# EAGLE design 405_led_jetracer020002S (EAGLE 9.6.2)

## Sheet 1 of 2
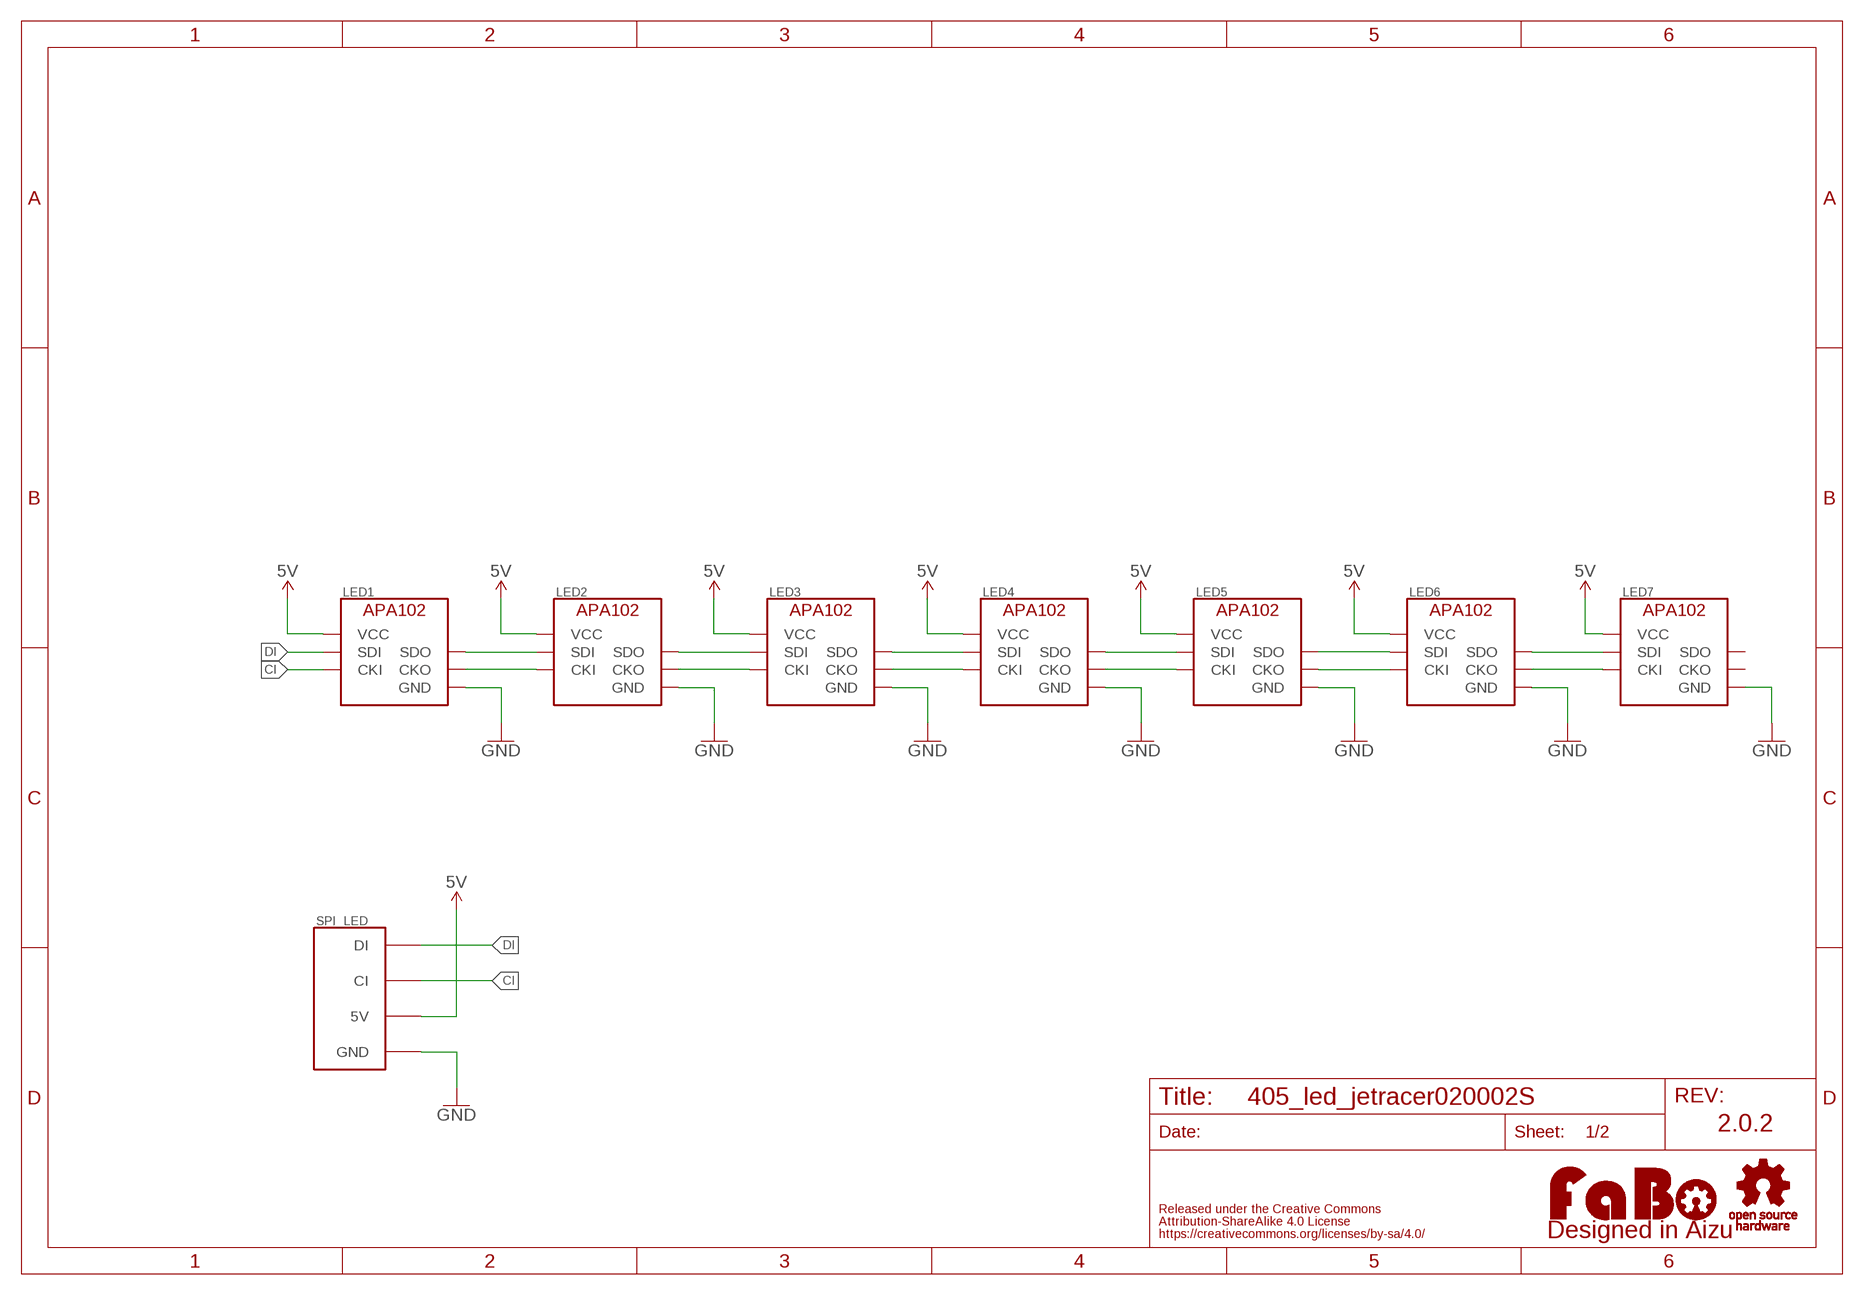
[diagram p0: schematic, sheet 1]

### Parts
LED1  APA102_IPIXEL  [APA102_2020]
LED2  APA102_IPIXEL  [APA102_2020]
LED3  APA102_IPIXEL  [APA102_2020]
LED4  APA102_IPIXEL  [APA102_2020]
LED5  APA102_IPIXEL  [APA102_2020]
LED6  APA102_IPIXEL  [APA102_2020]
LED7  APA102_IPIXEL  [APA102_2020]
LOGO1  LOGO_OSHW-S_BOTTOM  [LOGO_OSHW_S_BOTTOM]
LOGO2  LOGO_FABO-S  [LOGO_FABO_S]
SPI_LED  SPI-LED  FABO_BRICK_SPI_LED-S04B-PASK-2  [FABO_BRICK_SPI_LED_S04B-PASK-2]

### Nets
5V: LED1.VCC LED2.VCC LED3.VCC LED4.VCC LED5.VCC LED6.VCC LED7.VCC SPI_LED.5V
CI: LED1.CKI SPI_LED.CI
CI1: LED1.CKO LED2.CKI
CI2: LED2.CKO LED3.CKI
CI3: LED3.CKO LED4.CKI
CI4: LED4.CKO LED5.CKI
CI5: LED5.CKO LED6.CKI
DI: LED1.SDI SPI_LED.DI
DI1: LED1.SDO LED2.SDI
DI2: LED2.SDO LED3.SDI
DI3: LED3.SDO LED4.SDI
DI4: LED4.SDO LED5.SDI
DI5: LED5.SDO LED6.SDI
GND: LED1.GND LED2.GND LED3.GND LED4.GND LED5.GND LED6.GND LED7.GND SPI_LED.GND
N$3: LED6.SDO LED7.SDI
N$4: LED6.CKO LED7.CKI
Unconnected: LED7.CKO LED7.SDO

### Notes on the sheet
- 2.0.2

## Sheet 2 of 2
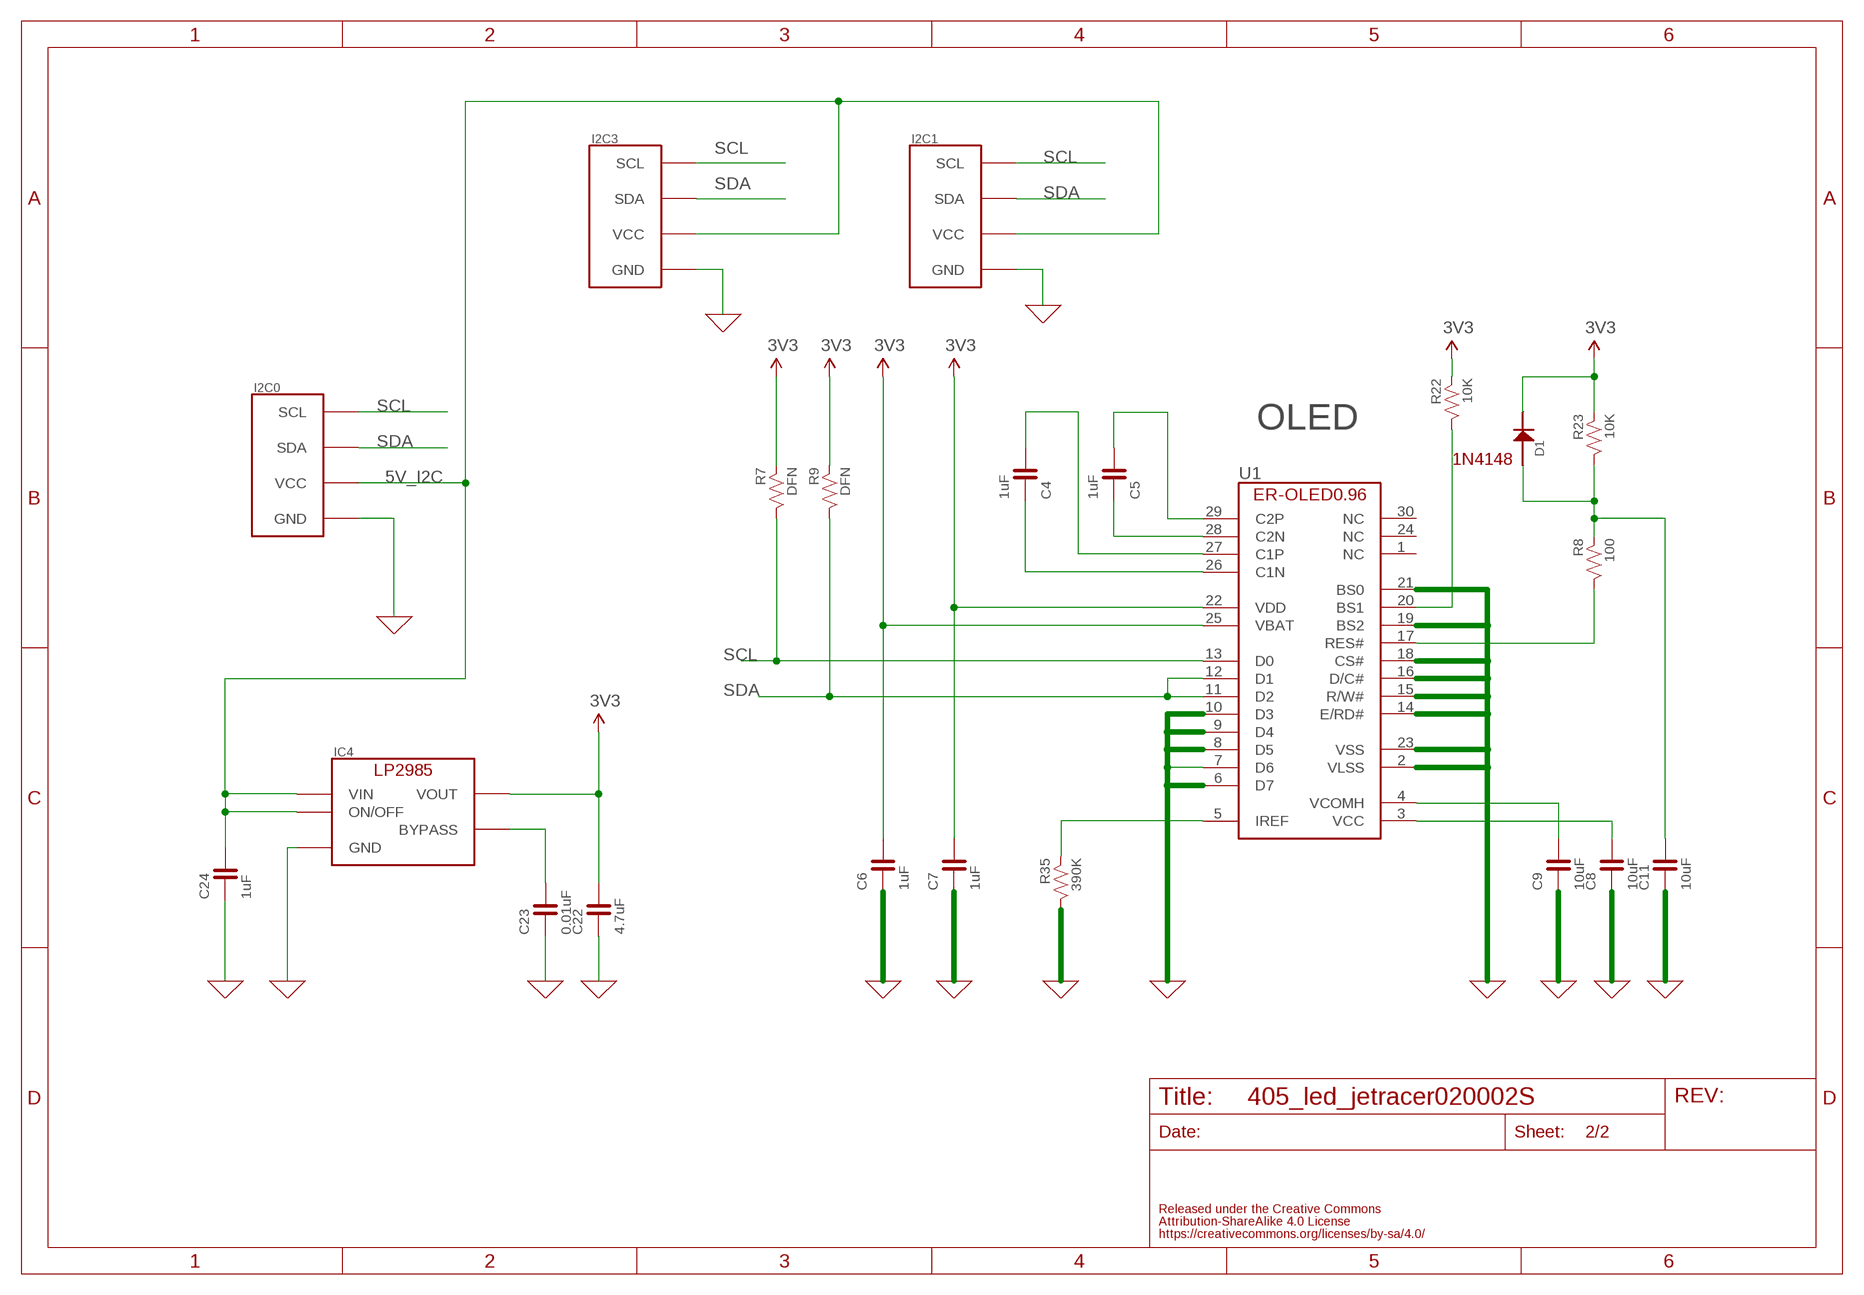
[diagram p1: schematic, sheet 2]

### Parts
C4  1uF  CAPACITOR-0603  [0603]
C5  1uF  CAPACITOR-0603  [0603]
C6  1uF  CAPACITOR-0603  [0603]
C7  1uF  CAPACITOR-0603  [0603]
C8  10uF  CAPACITOR-0603  [0603]
C9  10uF  CAPACITOR-0603  [0603]
C11  10uF  CAPACITOR-0603  [0603]
C22  4.7uF  CAPACITOR-0603  [0603]
C23  0.01uF  CAPACITOR-0603  [0603]
C24  1uF  CAPACITOR-0603  [0603]
D1  1N4148  [1N4148W]
I2C0  FABO_BRICK_I2C-S04B-PASK-2  [FABO_BRICK_I2C_S04B-PASK-2]
I2C1  FABO_BRICK_I2C-S04B-PASK-2  [FABO_BRICK_I2C_S04B-PASK-2]
I2C3  FABO_BRICK_I2C-S04B-PASK-2  [FABO_BRICK_I2C_S04B-PASK-2]
IC4  LP2985-33DBV  [SOT-23-5]
R7  DFN  RESISTOR-0603  [0603]
R8  100  RESISTOR-0603  [0603]
R9  DFN  RESISTOR-0603  [0603]
R22  10K  RESISTOR-0603  [0603]
R23  10K  RESISTOR-0603  [0603]
R35  390K  RESISTOR-0603  [0603]
U1  ER-OLED0.96-1ER-CON30HT-1  [ER-CON30HT-1]

### Nets
0: C6.1 C7.1 C8.1 C9.1 C11.1 C22.1 C23.1 C24.1 I2C0.GND I2C1.GND I2C3.GND IC4.2(GND) R35.2 U1.2(VLSS) U1.6(D7) U1.7(D6) U1.8(D5) U1.9(D4) U1.10(D3) U1.14(E/RD#) U1.15(R/W#) U1.16(D/C#) U1.18(CS#) U1.19(BS2) U1.21(BS0) U1.23(VSS) ; supply symbol labelled GND
3V3: C6.2 C7.2 C22.2 D1.CATHODE IC4.5(VOUT) R7.1 R9.1 R22.1 R23.1 U1.22(VDD) U1.25(VBAT)
5V_I2C: C24.2 I2C0.VCC I2C1.VCC I2C3.VCC IC4.1(VIN) IC4.3(ON/OFF)
N$2: C23.2 IC4.4(BYPASS)
N$16: C4.2 U1.27(C1P)
N$21: C4.1 U1.26(C1N)
N$22: C5.1 U1.28(C2N)
N$23: C5.2 U1.29(C2P)
N$24: R35.1 U1.5(IREF)
N$25: C9.2 U1.4(VCOMH)
N$26: C8.2 U1.3(VCC)
N$27: R8.2 U1.17(RES#)
N$28: C11.2 D1.ANODE R8.1 R23.2
N$50: R22.2 U1.20(BS1)
SCL: I2C0.SCL I2C1.SCL I2C3.SCL R7.2 U1.13(D0)
SDA: I2C0.SDA I2C1.SDA I2C3.SDA R9.2 U1.11(D2) U1.12(D1)
Unconnected: U1.1(NC) U1.24(NC) U1.30(NC)

### Notes on the sheet
- OLED
- 1N4148

## Library data of the parts
C4-C9 C11 C22-C24 = FaBo-Capacitor:CAPACITOR: CAPACITOR
D1 = FaBo-Diode:1N4148
I2C0 I2C1 I2C3 = FaBo-Template:FABO_BRICK_I2C: FaBo Brick I2C
IC4 = FaBo-Supply:LP2985: LP2985
LED1-LED7 = FaBo-LED:APA102
LOGO1 = FaBo-Logo:LOGO_OSHW
LOGO2 = FaBo-Logo:LOGO_FABO
R7-R9 R22 R23 R35 = FaBo-Resistors:RESISTOR: RESISTOR
SPI_LED = FaBo-Template:FABO_BRICK_SPI_LED
U1 = FaBo-Display:ER-OLED0.96-1

## Board
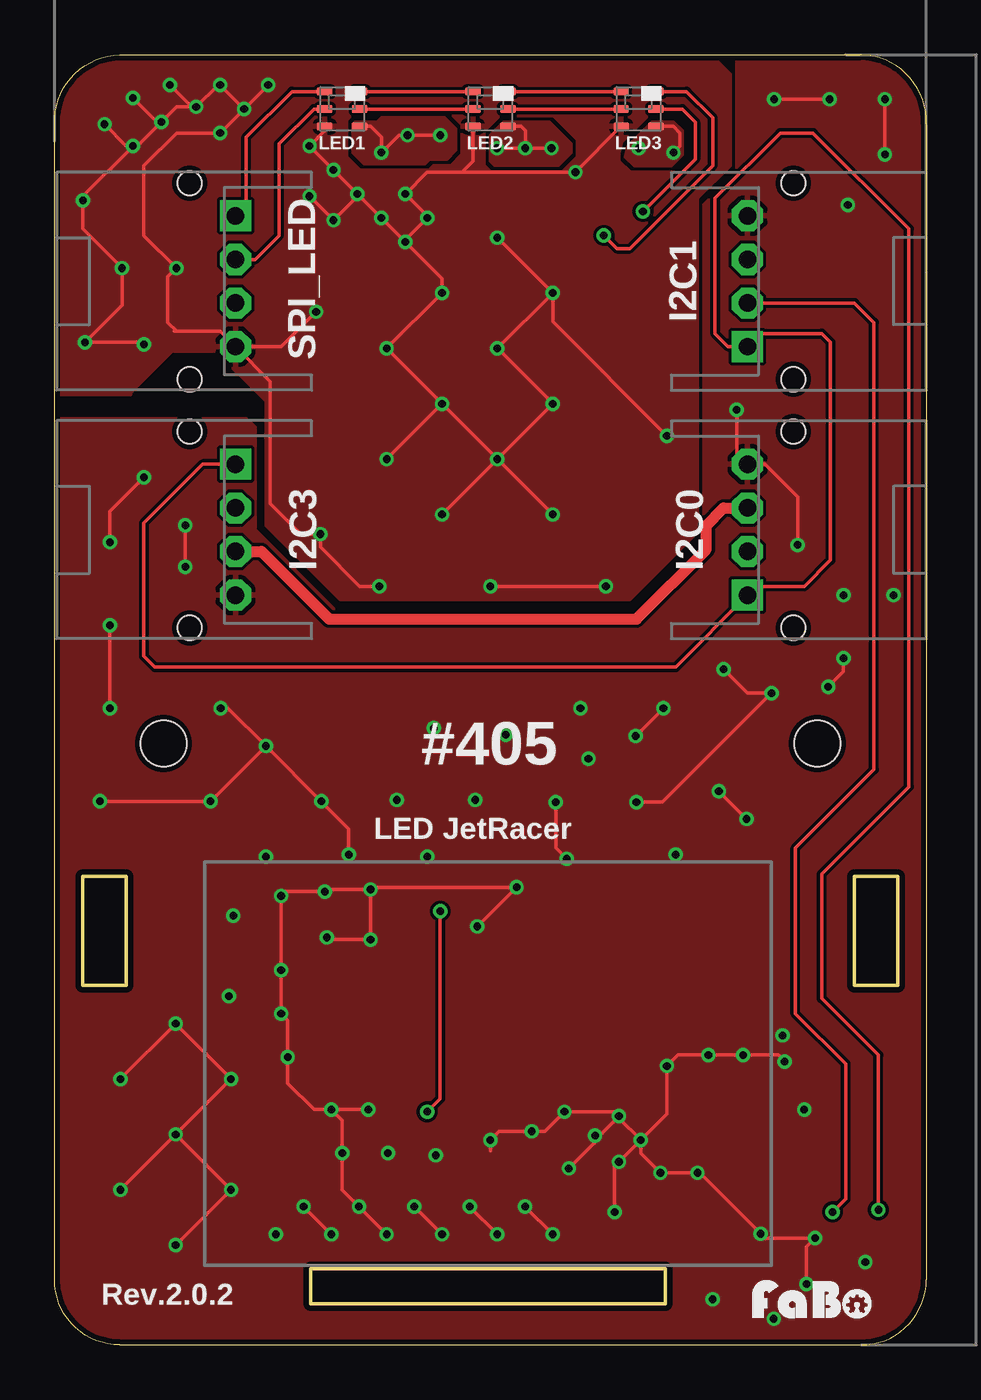
[diagram p2: board, top side]
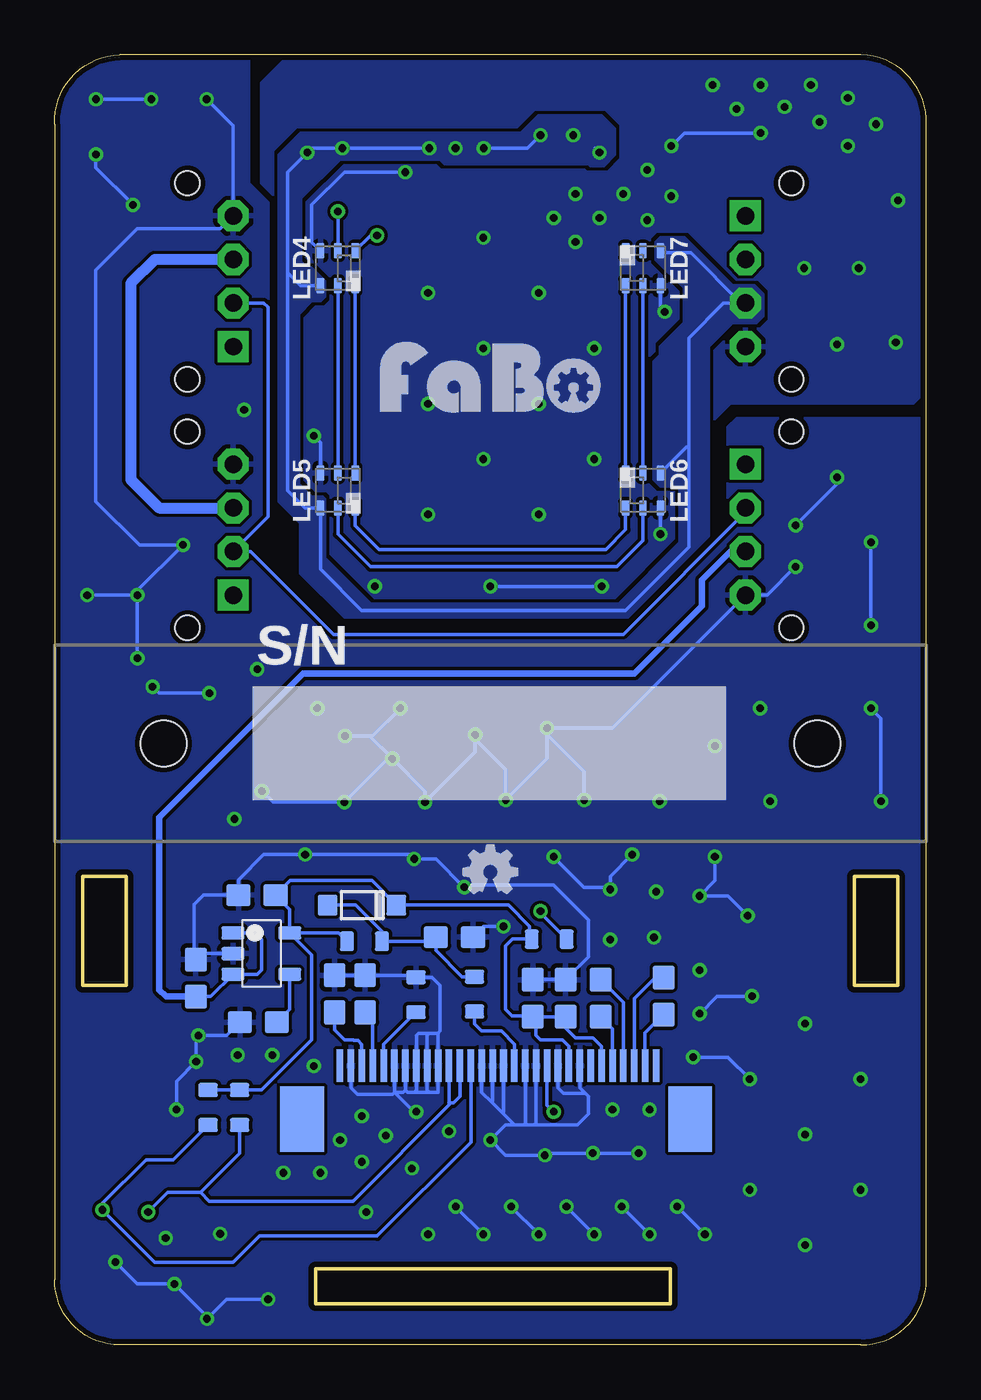
[diagram p3: board, bottom side, seen from below]

Size 40 x 59.2 mm. Coordinates in mm from the lower left corner, seen from the top.
Outline: 3,0 37,0 arc90 40,3 40,56 arc90 37,59.2 3,59.2 arc90 0,56 0,3 arc90 3,0
Outline: 11.75,1.89 28.03,1.89 28.03,3.5 11.75,3.5 11.75,1.89
Outline: 1.3,21.5 3.3,21.5 3.3,16.5 1.3,16.5 1.3,21.5
Outline: 36.7,21.5 38.7,21.5 38.7,16.5 36.7,16.5 36.7,21.5
Copper layers (1*16): Top 0.035mm / dielectric 1.6mm / Bottom 0.035mm
Design rules "PCBway": minimum track width 6mil, minimum drill 12mil, track to track 6mil, track to pad 6mil, pad to pad 6mil, via to via 6mil, smd to smd 6mil, copper to edge 10mil, drill to drill 10mil, minimum pad ring 10mil, minimum via ring 6mil, stop-mask expansion 2mil, vias tented up to drill 100mil, thermal gap 8mil
Holes 2.1 mm at 5,27.6 35,27.6
bRestrict: 8 lines

### Footprints (pad centres in the part's own frame; a part is rotated, then mirrored left to right if it is on the bottom)
0603 = smd 1.1 x 1: 1 -0.85,0; 2 0.85,0
1N4148W = smd 0.9 x 0.95: ANODE 0,0; CATHODE 3.15,0
FABO_BRICK_I2C_S04B-PASK-2 = drill 0.8 pad 1.422 octagon: GND -3,0; SDA 1,0; VCC -1,0 | drill 0.8 pad 1.422 square: SCL 3,0 | hole 1.1: 4.5,2.1; -4.5,2.1
SOT-23-5 = smd 0.6 x 1.05: 1 -0.95,-1.3; 2 0,-1.3; 3 0.95,-1.3; 4 0.95,1.3; 5 -0.95,1.3
APA102_2020 = smd 0.7 x 0.35: CKI 0.8,0; CKO -0.8,0; GND 0.8,0.8; SDI 0.8,-0.8; SDO -0.8,-0.8; VCC -0.8,0.8
0603' = smd 0.65 x 0.9: 1 -0.8,0; 2 0.8,0
FABO_BRICK_SPI_LED_S04B-PASK-2 = drill 0.8 pad 1.422 octagon: 5V -1,0; CI 1,0; GND -3,0 | drill 0.8 pad 1.422 square: DI 3,0 | hole 1.1: 4.5,2.1; -4.5,2.1
ER-CON30HT-1 = smd 0.3 x 1.5 bottom: 1 7,-0.23; 2 6.5,-0.23; 3 6,-0.23; 4 5.5,-0.23; 5 5,-0.23; 6 4.5,-0.23; 7 4,-0.23; 8 3.5,-0.23; 9 3,-0.23; 10 2.5,-0.23; 11 2,-0.23; 12 1.5,-0.23; 13 1,-0.23; 14 0.5,-0.23; 15 0,-0.23; 16 -0.5,-0.23; 17 -1,-0.23; 18 -1.5,-0.23; 19 -2,-0.23; 20 -2.5,-0.23; 21 -3,-0.23; 22 -3.5,-0.23; 23 -4,-0.23; 24 -4.5,-0.23; 25 -5,-0.23; 26 -5.5,-0.23; 27 -6,-0.23; 28 -6.5,-0.23; 29 -7,-0.23; 30 -7.5,-0.23 | smd 2 x 3 bottom: 31 -9.07,-2.67; 32 8.74,-2.67

### Placement (x,y rotation side)
C4  14.95,15.91 90 bottom
C5  12.05,16.01 270 bottom
C6  18.05,15.91 270 bottom
C7  16.55,15.91 270 bottom
C8  27.15,16.11 270 bottom
C9  25.75,16.11 270 bottom
C11  21.65,18.71 180 bottom
C22  30.7,20.64 0 bottom
C23  30.64,14.81 0 bottom
C24  33.52,16.84 270 bottom
D1  27.47,20.18 0 bottom
I2C0  31.8,37.4 270 top
I2C1  31.8,48.8 270 top
I2C3  8.3,37.4 90 top
IC4  30.5,17.95 270 bottom
LED1  13.2,56.7 180 top
LED2  20,56.7 180 top
LED3  26.8,56.7 180 top
LED4  27,49.4 90 bottom
LED5  27,39.2 90 bottom
LED6  13,39.2 270 bottom
LED7  13,49.4 270 bottom
LOGO1  20,21.7 0 top
LOGO2  34.81,1.07 0 top
R7  DFN  [0603']  32.95,10.89 270 bottom
R8  100  [0603']  20.73,16.09 270 bottom
R9  DFN  [0603']  31.5,10.89 270 bottom
R22  10K  [0603']  17.3,18.62 0 bottom
R23  10K  [0603']  25.78,18.52 0 bottom
R35  390K  [0603']  23.41,16.07 90 bottom
SPI_LED  8.3,48.8 90 top
U1  19.9,13.04 0 top
U$3  [LOGO_FABO_M_BOTTOM]  20,42.4 0 top

### Tracks (layer width: path | path; a pad name or v marks a point on that pad's centre or on a via)
0  (via drill 0.35)
  Top 0.152: v19.4,19.2 v21.2,21 14.72,21 14.5,20.78 | 14.5,20.78 v14.5,20.9 12.5,20.9 v12.4,20.8 10.6,20.8 v10.4,20.6 v10.4,17.2 v10.4,15.2 10.7,14.9 v10.7,13.2 10.7,12.01 11.91,10.8 v12.7,10.8 | 14.5,20.78 v14.5,18.6 12.6,18.6 v12.5,18.7 | v12.7,10.8 v14.4,10.8 | v12.7,10.8 13.2,10.3 v13.2,8.8 13.2,7.12 v13.97,6.35 v15.24,5.08 | 20,8.9 v20,9.4 20.4,9.8 v21.9,9.8 22.5,9.8 v23.4,10.7 25.7,10.7 v25.9,10.5 | v25.9,10.5 25,9.6 v24.8,9.6 24.8,9.3 v23.6,8.1 23.7,8.1 | 29.4,7.8 v29.5,7.9 | v29.5,7.9 v27.8,7.9 26.9,8.8 26.9,9.3 | 26.9,9.3 v26.9,9.4 | v26.9,9.4 25.9,10.4 v25.9,10.5 | 26.9,9.3 26.8,9.3 v25.9,8.4 25.7,8.2 v25.7,6.1 | v26.9,9.4 28.1,10.6 v28.1,12.8 28.6,13.3 v30,13.3 v31.6,13.3 33.2,13.3 v33.5,13 | v23.5,22.3 23,22.8 v23,24.9 | v34.1,36.7 34.1,38.9 32.6,40.4 I2C0.GND 31.3,40.9 v31.3,42.9 | v6,35.7 v6,37.6 | v26.7,24.9 27.9,24.9 v32.9,29.9 31.8,29.9 v30.7,31 | v5.56,4.58 v8.1,7.12 v5.56,9.66 | v3.02,7.12 v5.56,9.66 | v5.56,9.66 v8.1,12.2 v5.56,14.74 v3.02,12.2 | v2.08,24.94 v7.16,24.94 v9.7,27.48 | v9.7,27.48 v12.24,24.94 13.5,23.68 v13.5,22.5 | v12.7,5.08 v11.43,6.35 | v16.51,6.35 v17.78,5.08 | v19.05,6.35 v20.32,5.08 | v21.59,6.35 v22.86,5.08 | v2.54,29.21 v2.54,33.02 | v2.54,36.83 2.54,38.24 v4.1,39.8 | v9.7,27.48 7.97,29.21 v7.62,29.21 | v26.67,27.94 v27.94,29.21 | v30.48,25.4 v31.75,24.13 | v33.02,57.15 v35.56,57.15 | v38.1,57.15 v38.1,54.61 | v35.5,30.2 36.2,30.9 v36.2,31.5 | v34.5,2.8 34.5,4.5 v34.9,4.9 32.6,4.9 v32.4,5.1 29.6,7.9 v29.5,7.9
  Bottom 0.152: C6.1 C7.1 15.5,17.81 15.5,19.5 17.1,21.1 21.1,21.1 v21.2,21 22.5,22.3 v23.5,22.3 23.7,22.5 v28.5,22.5 30.4,22.5 31.55,21.34 C22.1 33.16,20.64 33.6,20.2 33.6,18.2 33.3,17.9 | 22.4,14.3 22.3,14.4 22.3,16.5 22.67,16.87 R35.2 23.5,16.96 C9.1 C8.1 27.25,17.06 27.4,17.06 | 22.4,14.3 U1.10 22.4,11.6 22.8,11.6 | 22.8,14.3 22.9,14.2 U1.9 22.9,11.7 22.8,11.6 | 22.8,14.3 22.4,14.3 | 22.8,14.3 23.3,14.3 23.4,14.2 U1.8 23.4,11.7 23.5,11.6 | U1.7 23.9,11.7 | 23.9,11.7 23.8,11.6 23.5,11.6 | U1.6 24.4,11.6 | 24.4,11.6 24,11.6 23.9,11.7 | v19.4,19.2 20.31,19.2 C11.1 | 23.5,11.6 22.8,11.6 | U1.23 15.9,11.8 15.65,11.55 | 15.65,11.55 15.5,11.4 15.5,10.6 16,10.1 18,10.1 | 18,10.1 18.4,10.1 | 19.9,11.1 U1.15 | U1.18 18.4,10.1 | U1.19 17.9,10.2 18,10.1 | U1.21 16.9,11.8 16.65,11.55 15.65,11.55 | IC4.2 33.24,17.95 33.3,17.9 | 33.3,17.9 C24.1 | C23.1 32.1,14.2 v33.4,14.2 33.5,14.2 v33.5,13 34.4,12.1 v34.4,10.8 34.5,10.7 | 18.4,10.1 18.9,10.1 | 18.9,10.1 19.4,10.6 | 19.4,10.6 19.9,11.1 | U1.16 19.4,10.6 | 19.9,11.1 20.4,11.6 U1.14 | 24.4,11.6 23.5,10.7 v23.4,10.7 | 18.9,10.1 19.3,10.1 v20,9.4 19.3,8.7 17.6,8.7 | U1.2 26.4,11.8 26.1,11.5 24.5,11.5 24.4,11.6 | v8.1,12.2 9.1,13.2 v10.7,13.2 | v8,16 9.6,16 v10.4,15.2 | v8.2,19.7 9.1,20.6 v10.4,20.6 9.7,21.3 v9.7,22.4 | v13.5,22.5 14.5,21.5 14.5,21 | 14.5,21 v14.5,20.9 | v17.1,22.4 15.7,21 14.5,21 | v24.5,26.9 24.7,26.9 v26.7,24.9 29.98,24.9 v30.48,25.4 | v24.5,26.9 23,25.4 v23,24.9 20.7,27.2 v20.7,28 | v17.4,28.3 17.4,26.9 v19.3,25 19.3,26.4 20.7,27.8 v20.7,28 | v20.7,28 20.8,28 | v17.4,28.3 17.4,28 15.7,26.3 v15.7,25 | v17.4,28.3 14.4,28.3 I2C3.GND 7.3,34.4 v6,35.7 | v36.2,34.4 36.2,34.6 v34.1,36.7 36.1,36.7 38.1,38.7 38.1,49.3 36.2,51.2 32.4,51.2 I2C1.GND 31.8,55.93 v33.02,57.15
  Bottom 0.152: v13.2,8.8 v15.3,8.8 17.5,8.8 17.6,8.7 | v17.5,8.7 17.6,8.7 | v6,37.6 4.1,39.5 v4.1,39.8 | v36.2,34.4 v36.2,31.5 | v13.97,6.35 v12.7,5.08 | v11.43,6.35 v10.16,5.08 | v15.24,5.08 v16.51,6.35 | v17.78,5.08 v19.05,6.35 | v20.32,5.08 v21.59,6.35 | v2.08,24.94 2.08,28.75 v2.54,29.21 | v2.54,33.02 v2.54,36.83 | v24.5,26.9 25.54,27.94 v26.67,27.94 25.4,27.94 v24.13,29.21 | v35.56,57.15 v38.1,57.15 | v32.9,29.9 35.2,29.9 v35.5,30.2 | v36.2,34.4 v38.5,34.4 | v38.1,54.61 38.1,54 v36.4,52.3 | v30.2,2.1 32.1,2.1 v33,1.2 33,1.3 v34.5,2.8 36.2,2.8 v37.2,3.8
  pour Top: -1.4,42.5 8.8,42.5 9.2,42.1 9.2,37.4 12.9,33.7 26.4,33.7 29.8,37.1 29.8,52.3 31.3,53.8 31.3,59.2 32.9,60.8 39.6,60.8 41.6,58.8 41.6,-1 37.6,-5 3.9,-5 -1.7,0.6 -1.7,42.2
  pour Bottom: -2.7,41.2 -1.4,42.5 8.7,42.5 9.1,42.1 9.1,37.5 13.8,32.8 27.1,32.8 30.2,35.9 30.2,52.4 31.1,53.3 31.1,59.9 32.3,61.1 39.3,61.1 42.3,58.1 42.3,-1.1 37.9,-5.5 3.1,-5.5 -2.7,0.3
3V3
  Bottom 0.152: U1.25 14.9,13.7 15.3,14.1 16.1,14.1 16.55,14.55 C7.2 17.9,15.06 | 17.9,15.06 C6.2 18.09,15.1 19,15.1 19.3,15.4 19.3,18.3 18.98,18.62 18.2,18.62 | U1.22 16.4,13.7 16.7,14 17.7,14 17.9,14.2 17.9,15.06 | 18.2,18.62 R22.1 | 18.2,18.62 18.2,19.2 19.18,20.18 D1.CATHODE 25.44,21.3 29.19,21.3 C22.2 29.2,19.98 IC4.5 | R23.1 26.96,18.91 IC4.5 | IC4.5 28.2,17.9 28.2,14 30.5,11.7 R9.1 R7.1
5V  (via drill 0.35)
  Top 0.152: LED1.VCC 14.5,55.9 15,55.4 v15,54.7 15.8,55.5 v16.2,55.5 v17.7,55.5 | v21.6,54.9 21.6,55.7 21.4,55.9 LED2.VCC | v28.4,54.7 28.7,55 28.7,55.6 28.4,55.9 LED3.VCC | v21.6,54.9 v20.3,54.9 | v21.6,54.9 v22.8,54.9
  Bottom 0.152: SPI_LED.5V 8.5,47.8 | 8.5,47.8 9.3,47.8 10.9,46.2 10.9,41.2 | v15,54.7 15.2,54.9 | LED4.VCC 28.7,48.6 29.3,49.2 | 29.3,49.2 29.3,53.8 v28.4,54.7 28.2,54.9 v26.8,54.9 v22.8,54.9 | 29.3,49.2 29.3,39.2 28.5,38.4 LED5.VCC 27.8,35.6 25.9,33.7 13.8,33.7 10.9,36.6 10.9,41.2 | LED7.VCC 12.1,50.1 10.8,50.1 8.5,47.8 | LED6.VCC 11,41.2 10.9,41.2 | v20.3,54.9 18.3,54.9 v17.7,55.5
  pour Bottom (no thermals): 7.5,47.2 7.5,48.2 7.9,48.6 8.9,48.6 11.1,50.8 12.2,50.8 12.4,50.6 12.4,49.8 11.1,48.5 11.1,46.9 12.2,45.8 12.2,45.4 12.5,45.1 12.5,39.7 12.2,39.4 11.3,39.4 11.3,36.8 14.1,34 25.5,34 27.6,36.1 27.6,38.8 27.7,38.9 28.2,38.9 28.8,39.5 28.8,47.3 28.2,47.9 27.8,47.9 27.6,48.1 27.6,48.8 28.2,49.4 28.4,49.4 28.7,49.7 28.7,52.6 26.9,54.4 22.3,54.4 22.1,54.2 15.5,54.2 15.4,54.1 14.8,54.1 14.3,54.6 14.3,55.8 14.9,56.4 17.8,56.4 18.6,55.6 28.7,55.6 29.7,54.6 29.7,38.7 28.7,37.7 28.7,35.4 26.7,33.4 13.7,33.4 10,37.1 10,45.8 8.9,46.9 7.8,46.9
  pour Top (no thermals): 13.7,54.7 13.7,56 13.8,56.1 14.8,56.1 15,56.3 17.9,56.3 18.4,55.8 18.4,54.8 18,54.4 17.2,54.4 17,54.2 14.2,54.2
  pour Top (no thermals): 20,54.3 20,55.5 20.6,56.1 22.7,56.1 23.7,55.1 23.7,54.7 23,54 20.3,54
  pour Top (no thermals): 26.3,55 27.4,56.1 28.4,56.1 28.8,55.7 28.8,54.6 28.3,54.1 26.6,54.1 26.2,54.5
5V_I2C
  Top 0.508: I2C3.VCC 9.5,36.4 12.6,33.3 26.7,33.3 29.9,36.5 29.9,37.6 30.7,38.4 I2C0.VCC
  Bottom 0.152: IC4.1 30.8,18.9 30.5,18.6 30.5,17.2 30.7,17 IC4.3 32.83,15.98 C24.2
  Bottom 0.305: C24.2 34.88,15.98 35.2,16.3 35.2,24.2 28.6,30.8 13.4,30.8 10.3,33.9 10.3,35.1 9,36.4 I2C3.VCC
  Bottom 0.508: I2C1.VCC 35.4,49.8 36.5,48.7 36.5,39.7 35.2,38.4 I2C0.VCC
CI
  Top 0.152: SPI_LED.CI 9.2,49.8 10.3,50.9 10.3,55.1 11.9,56.7 LED1.CKI
CI1
  Top 0.152: LED1.CKO LED2.CKI
CI2
  Top 0.152: LED2.CKO LED3.CKI
CI3  (via drill 0.35)
  Top 0.152: LED3.CKO 28.8,56.7 29.4,56.1 29.4,54.4 v27,52
  Bottom 0.152: v27,52 LED4.CKI
CI4
  Bottom 0.152: LED4.CKO LED5.CKI
CI5
  Bottom 0.152: LED5.CKO 27,37.2 25.5,35.7 14.2,35.7 13,36.9 LED6.CKI
DI
  Top 0.152: SPI_LED.DI 8.8,52.3 8.8,55.4 10.9,57.5 LED1.SDI
DI1
  Top 0.152: LED1.SDO LED2.SDI
DI2
  Top 0.152: LED2.SDO LED3.SDI
DI3  (via drill 0.35)
  Top 0.152: LED3.SDO 29,57.5 30.2,56.3 30.2,54.1 26.4,50.3 25.8,50.3 v25.2,50.9
  Bottom 0.152: LED4.SDI 25.5,50.9 v25.2,50.9
DI4
  Bottom 0.152: LED4.SDO LED5.SDI
DI5
  Bottom 0.152: LED5.SDO 26.2,37.6 25.1,36.5 14.7,36.5 13.8,37.4 LED6.SDI
GND  (via drill 0.35)
  Top 0.152: LED3.GND v23.9,53.8 18.7,53.8 | 18.7,53.8 17.1,53.8 v16.1,52.8 17.1,51.8 v17.1,51.7 16.1,50.7 v16.1,50.6 | SPI_LED.GND 9.9,44.2 9.9,38.6 11.3,37.2 v12.2,37.2 12.2,36.6 14,34.8 v14.9,34.8 | v12,47.4 10.4,45.8 SPI_LED.GND | SPI_LED.GND 7.6,46.5 5.6,46.5 | 5.6,46.5 5.5,46.5 | LED1.GND 12.4,55.7 v11.7,55 v12.8,53.9 v13.9,52.8 | v16.1,50.6 v15,51.7 v13.9,52.8 | v13.9,52.8 13.9,52.7 v12.8,51.6 v11.7,52.7 | v2.3,56 3.3,55 v3.6,55 | v3.6,55 3.8,55 v4.9,56.1 | v4.9,56.1 4.7,56.1 v3.6,57.2 | v4.9,56.1 5.6,56.8 v6.5,56.8 | v5.3,57.8 6.3,56.8 v6.5,56.8 | v6.5,56.8 7.5,57.8 v7.6,57.8 v8.7,56.7 | v8.7,56.7 v7.6,55.6 5.6,55.6 4.1,54.1 4.1,50.9 v5.6,49.4 5.2,49 5.2,46.9 5.6,46.5 | v8.7,56.7 v9.8,57.8 | v20,34.8 v25.3,34.8 | LED2.GND 19.2,54.3 18.7,53.8 | v16.1,50.6 17.78,48.92 v17.78,48.26 v15.24,45.72 v17.78,43.18 | v17.78,43.18 v15.24,40.64 | v17.78,43.18 v20.32,40.64 | v20.32,40.64 v17.78,38.1 | v20.32,40.64 v22.86,38.1 | v20.32,40.64 v22.86,43.18 v20.32,45.72 v22.86,48.26 | v22.86,48.26 v20.32,50.8 | v28.1,41.7 22.86,46.94 v22.86,48.26 | v3.6,55 1.3,52.7 v1.3,52.5 1.3,51.2 v3.1,49.4 3.1,47.7 v1.4,46 4,46 v4.1,45.9
  Bottom 0.152: LED4.GND 28.2,50.6 28.2,52.3 26.7,53.8 v23.9,53.8 | LED5.GND 27.8,41.4 v28.1,41.7 | v12,47.4 12.2,47.6 LED7.GND | v7.6,55.6 11.1,55.6 v11.7,55 | LED6.GND v12.2,37.2 | v14.9,34.8 v20,34.8
  pour Bottom (rank 6): -0.1,59.9 28.5,59.9 30.5,57.9 30.5,53.3 29.7,52.5 29.7,35.9 27,33.2 14,33.2 9.8,37.4 9.8,42.4 9,43.2 0.6,43.2 -0.1,43.9
  pour Top (rank 6): -0.7,60.8 28.5,60.8 31,58.3 31,54.1 29.5,52.6 29.5,37.3 26.4,34.2 13.1,34.2 9.7,37.6 9.7,43.3 7.4,45.6 5.4,45.6 3.5,43.7 3.5,43.6 -0.1,43.6 -0.7,44.2
N$2
  Bottom 0.152: C23.2 29.2,15.39 IC4.4
N$3
  Bottom 0.152: LED7.SDI LED6.SDO
N$4
  Bottom 0.152: LED7.CKI LED6.CKO
N$16
  Bottom 0.152: U1.27 13.9,15.71 C4.2
N$21
  Bottom 0.152: U1.26 14.4,14.51 C4.1
N$22
  Bottom 0.152: U1.28 13.4,15.9 12.44,16.86 C5.1
N$23
  Bottom 0.152: C5.2 12.9,14.31 U1.29
N$24
  Bottom 0.152: R35.1 24.9,13.79 U1.5
N$25
  Bottom 0.152: U1.4 25.4,14.91 C9.2
N$26
  Bottom 0.152: U1.3 25.9,13.8 26.08,13.98 26.29,13.98 26.3,14 26.7,14 27.15,14.45 C8.2
N$27
  Bottom 0.152: U1.17 18.9,13.8 19.5,14.4 20.4,14.4 20.73,14.73 R8.2
N$28
  Bottom 0.152: R8.1 21.3,16.89 22.5,18.1 C11.2 | C11.2 | C11.2 22.68,18.52 R23.2 24.98,18.98 26.18,20.18 D1.ANODE
N$50  (via drill 0.35)
  Top 0.152: v17.7,19.9 17.7,11.3 v17.1,10.7
  Bottom 0.152: U1.20 17.4,11 v17.1,10.7 | v17.7,19.9 17.7,19.82 R22.2
SCL  (via drill 0.35)
  Top 0.152: I2C3.SCL 6.8,40.4 4.1,37.7 4.1,31.6 4.6,31.1 28.5,31.1 I2C0.SCL 32.2,34.8 34.4,34.8 35.6,36 35.6,46 35.2,46.4 32.4,46.4 I2C1.SCL 30.9,45.8 30.3,46.4 30.3,52.6 33.3,55.6 34.8,55.6 39.2,51.2 39.2,25.6 35.2,21.6 35.2,15.9 37.8,13.3 v37.8,6.2
  Bottom 0.152: 32.8,9.94 R7.2 34.55,8.5 35.8,8.5 37.8,6.5 v37.8,6.2 35.4,3.8 31.8,3.8 30.6,5 25.2,5 20.9,9.3 U1.13
SDA  (via drill 0.35)
  Top 0.152: I2C1.SDA 36.7,47.8 37.6,46.9 37.6,26.4 34,22.8 34,15.2 36.3,12.9 36.3,6.7 v35.7,6.1
  Bottom 0.152: U1.11 21.9,11.1 21.8,11.1 | U1.12 21.4,11.4 21.7,11.1 21.8,11.1 | I2C3.SDA 8.3,38.2 13.9,32.6 27.2,32.6 31,36.4 I2C0.SDA 30.2,38 30.2,47.6 30.4,47.8 I2C1.SDA | R9.2 31.5,8.79 33.3,7 | v35.7,6.1 34.8,7 33.3,7 | 21.8,11.1 26.3,6.6 32.9,6.6 33.3,7

### Text on the board
tPlace: #405 | LED JetRacer | Rev.2.0.2
bPlace: S/N
Document: #405 LED JetRacer Type S Rev2.0.2 / 2022/09/09